# Altium project radxa_cm3i_io_board_v1.4.PrjPcb (part 4 of 4)

## Sheet 22.SchDoc
size 297 x 209 mm
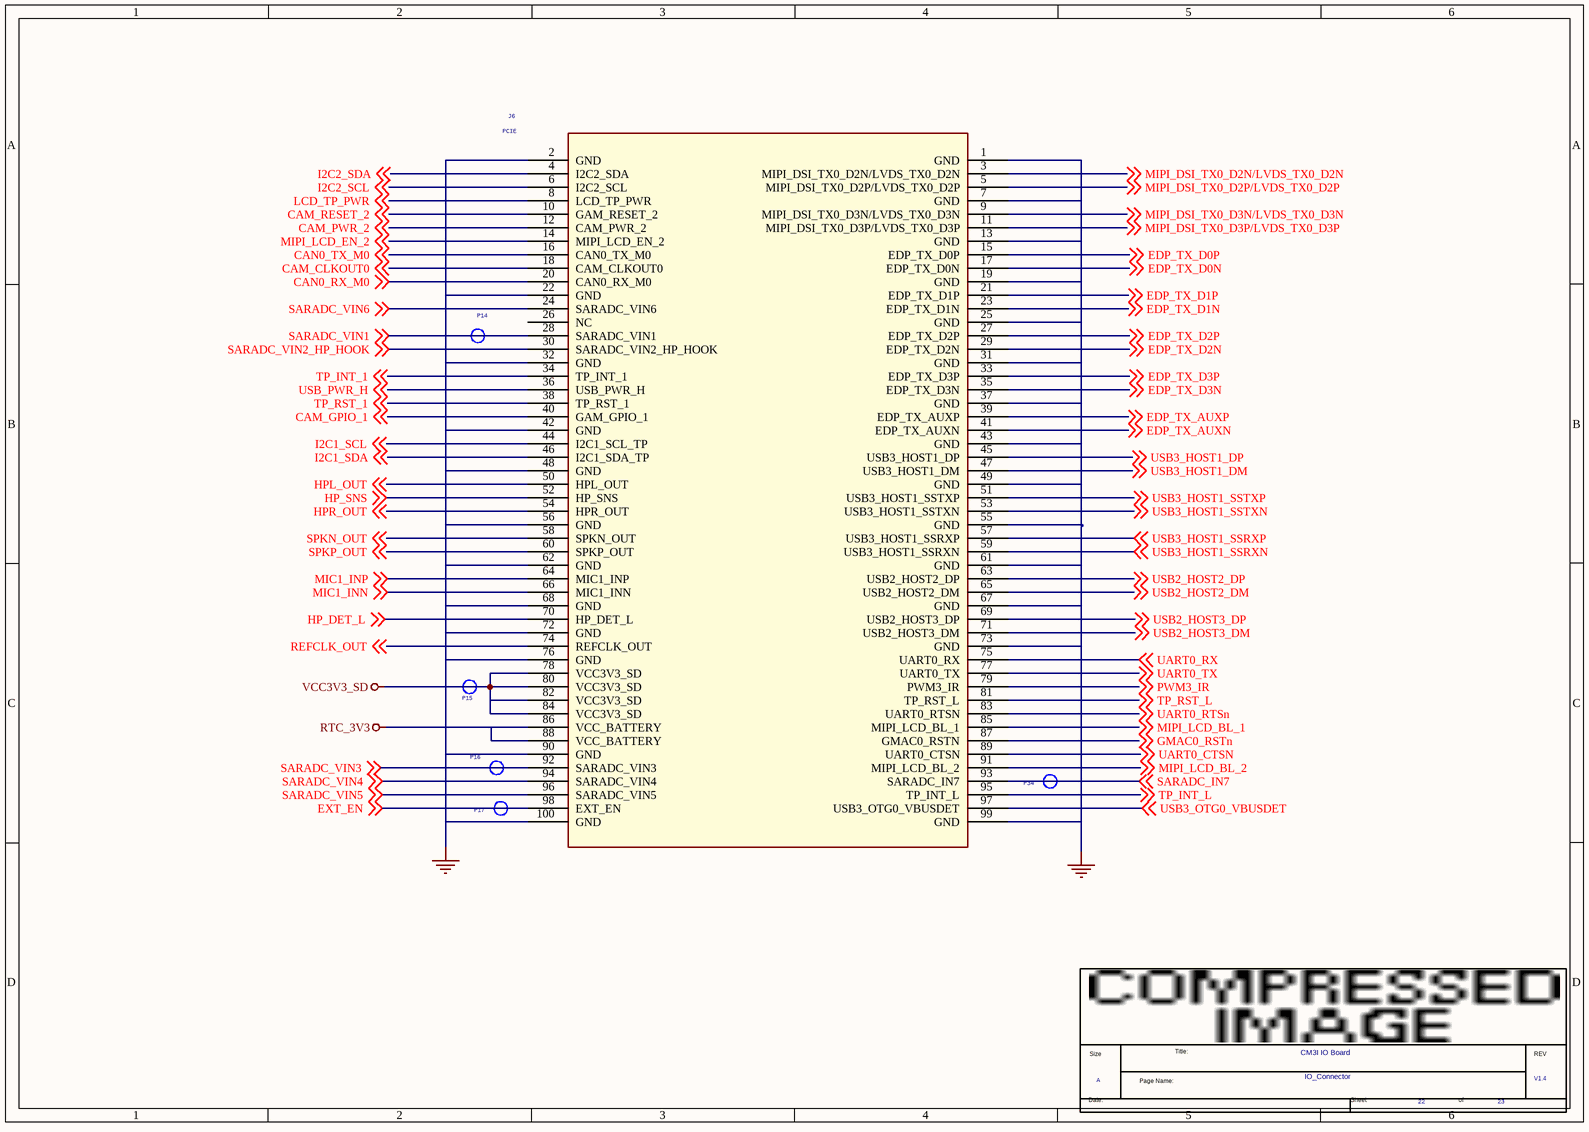
[diagram p20: 22.SchDoc]

### Parts
(Parts that share a designator on the sheet are numbered #1, #2 ... from top to bottom, then left to right.)
*#21  Page Count: 23  Page Number: 22  Page Size: A  Title: CM3I IO Board  RevCode: V1.4  Doc: IO_Connector  (hidden comment: radxa_1010)  (graphical)
J6  PCIE  [DF40C_100DS]
P14  TEST  [TEST]  (value not drawn)
P15  TEST  [TEST]  (value not drawn)
P16  TEST  [TEST]  (value not drawn)
P17  TEST  [TEST]  (value not drawn)
P34  TEST  [TEST]  (value not drawn)

### Nets
GND: J6.1(GND) J6.2(GND) J6.7(GND) J6.13(GND) J6.19(GND) J6.22(GND) J6.25(GND) J6.31(GND) J6.32(GND) J6.37(GND) J6.42(GND) J6.43(GND) J6.48(GND) J6.49(GND) J6.55(GND) J6.56(GND) J6.61(GND) J6.62(GND) J6.67(GND) J6.68(GND) J6.72(GND) J6.73(GND) J6.76(GND) J6.90(GND) J6.99(GND) J6.100(GND)
RTC_3V3: J6.86(VCC_BATTERY) J6.88(VCC_BATTERY)
VCC3V3_SD: J6.78(VCC3V3_SD) J6.80(VCC3V3_SD) J6.82(VCC3V3_SD) J6.84(VCC3V3_SD) P15.1
CAM_CLKOUT0: J6.18(CAM_CLKOUT0) ; off-sheet CAM_CLKOUT0
CAM_GPIO_1: J6.40(GAM_GPIO_1) ; off-sheet CAM_GPIO_1
CAM_PWR_2: J6.12(CAM_PWR_2) ; off-sheet CAM_PWR_2
CAM_RESET_2: J6.10(GAM_RESET_2) ; off-sheet CAM_RESET_2
CAN0_RX_M0: J6.20(CAN0_RX_M0) ; off-sheet CAN0_RX_M0
CAN0_TX_M0: J6.16(CAN0_TX_M0) ; off-sheet CAN0_TX_M0
EDP_TX_AUXN: J6.41(EDP_TX_AUXN) ; off-sheet EDP_TX_AUXN
EDP_TX_AUXP: J6.39(EDP_TX_AUXP) ; off-sheet EDP_TX_AUXP
EDP_TX_D0N: J6.17(EDP_TX_D0N) ; off-sheet EDP_TX_D0N
EDP_TX_D0P: J6.15(EDP_TX_D0P) ; off-sheet EDP_TX_D0P
EDP_TX_D1N: J6.23(EDP_TX_D1N) ; off-sheet EDP_TX_D1N
EDP_TX_D1P: J6.21(EDP_TX_D1P) ; off-sheet EDP_TX_D1P
EDP_TX_D2N: J6.29(EDP_TX_D2N) ; off-sheet EDP_TX_D2N
EDP_TX_D2P: J6.27(EDP_TX_D2P) ; off-sheet EDP_TX_D2P
EDP_TX_D3N: J6.35(EDP_TX_D3N) ; off-sheet EDP_TX_D3N
EDP_TX_D3P: J6.33(EDP_TX_D3P) ; off-sheet EDP_TX_D3P
EXT_EN: J6.98(EXT_EN) P17.1 ; off-sheet EXT_EN
GMAC0_RSTn: J6.87(GMAC0_RSTN) ; off-sheet GMAC0_RSTn
HP_DET_L: J6.70(HP_DET_L) ; off-sheet HP_DET_L
HP_SNS: J6.52(HP_SNS) ; off-sheet HP_SNS
HPL_OUT: J6.50(HPL_OUT) ; off-sheet HPL_OUT
HPR_OUT: J6.54(HPR_OUT) ; off-sheet HPR_OUT
I2C1_SCL: J6.44(I2C1_SCL_TP) ; off-sheet I2C1_SCL
I2C1_SDA: J6.46(I2C1_SDA_TP) ; off-sheet I2C1_SDA
I2C2_SCL: J6.6(I2C2_SCL) ; off-sheet I2C2_SCL
I2C2_SDA: J6.4(I2C2_SDA) ; off-sheet I2C2_SDA
LCD_TP_PWR: J6.8(LCD_TP_PWR) ; off-sheet LCD_TP_PWR
MIC1_INN: J6.66(MIC1_INN) ; off-sheet MIC1_INN
MIC1_INP: J6.64(MIC1_INP) ; off-sheet MIC1_INP
MIPI_DSI_TX0_D2N/LVDS_TX0_D2N: J6.3(MIPI_DSI_TX0_D2N/LVDS_TX0_D2N) ; off-sheet MIPI_DSI_TX0_D2N/LVDS_TX0_D2N
MIPI_DSI_TX0_D2P/LVDS_TX0_D2P: J6.5(MIPI_DSI_TX0_D2P/LVDS_TX0_D2P) ; off-sheet MIPI_DSI_TX0_D2P/LVDS_TX0_D2P
MIPI_DSI_TX0_D3N/LVDS_TX0_D3N: J6.9(MIPI_DSI_TX0_D3N/LVDS_TX0_D3N) ; off-sheet MIPI_DSI_TX0_D3N/LVDS_TX0_D3N
MIPI_DSI_TX0_D3P/LVDS_TX0_D3P: J6.11(MIPI_DSI_TX0_D3P/LVDS_TX0_D3P) ; off-sheet MIPI_DSI_TX0_D3P/LVDS_TX0_D3P
MIPI_LCD_BL_1: J6.85(MIPI_LCD_BL_1) ; off-sheet MIPI_LCD_BL_1
MIPI_LCD_BL_2: J6.91(MIPI_LCD_BL_2) ; off-sheet MIPI_LCD_BL_2
MIPI_LCD_EN_2: J6.14(MIPI_LCD_EN_2) ; off-sheet MIPI_LCD_EN_2
PWM3_IR: J6.79(PWM3_IR) ; off-sheet PWM3_IR
REFCLK_OUT: J6.74(REFCLK_OUT) ; off-sheet REFCLK_OUT
SARADC_IN7: J6.93(SARADC_IN7) P34.1 ; off-sheet SARADC_IN7
SARADC_VIN1: J6.28(SARADC_VIN1) P14.1 ; off-sheet SARADC_VIN1
SARADC_VIN2_HP_HOOK: J6.30(SARADC_VIN2_HP_HOOK) ; off-sheet SARADC_VIN2_HP_HOOK
SARADC_VIN3: J6.92(SARADC_VIN3) P16.1 ; off-sheet SARADC_VIN3
SARADC_VIN4: J6.94(SARADC_VIN4) ; off-sheet SARADC_VIN4
SARADC_VIN5: J6.96(SARADC_VIN5) ; off-sheet SARADC_VIN5
SARADC_VIN6: J6.24(SARADC_VIN6) ; off-sheet SARADC_VIN6
SPKN_OUT: J6.58(SPKN_OUT) ; off-sheet SPKN_OUT
SPKP_OUT: J6.60(SPKP_OUT) ; off-sheet SPKP_OUT
TP_INT_1: J6.34(TP_INT_1) ; off-sheet TP_INT_1
TP_INT_L: J6.95(TP_INT_L) ; off-sheet TP_INT_L
TP_RST_1: J6.38(TP_RST_1) ; off-sheet TP_RST_1
TP_RST_L: J6.81(TP_RST_L) ; off-sheet TP_RST_L
UART0_CTSN: J6.89(UART0_CTSN) ; off-sheet UART0_CTSN
UART0_RTSn: J6.83(UART0_RTSN) ; off-sheet UART0_RTSn
UART0_RX: J6.75(UART0_RX) ; off-sheet UART0_RX
UART0_TX: J6.77(UART0_TX) ; off-sheet UART0_TX
USB2_HOST2_DM: J6.65(USB2_HOST2_DM) ; off-sheet USB2_HOST2_DM
USB2_HOST2_DP: J6.63(USB2_HOST2_DP) ; off-sheet USB2_HOST2_DP
USB2_HOST3_DM: J6.71(USB2_HOST3_DM) ; off-sheet USB2_HOST3_DM
USB2_HOST3_DP: J6.69(USB2_HOST3_DP) ; off-sheet USB2_HOST3_DP
USB3_HOST1_DM: J6.47(USB3_HOST1_DM) ; off-sheet USB3_HOST1_DM
USB3_HOST1_DP: J6.45(USB3_HOST1_DP) ; off-sheet USB3_HOST1_DP
USB3_HOST1_SSRXN: J6.59(USB3_HOST1_SSRXN) ; off-sheet USB3_HOST1_SSRXN
USB3_HOST1_SSRXP: J6.57(USB3_HOST1_SSRXP) ; off-sheet USB3_HOST1_SSRXP
USB3_HOST1_SSTXN: J6.53(USB3_HOST1_SSTXN) ; off-sheet USB3_HOST1_SSTXN
USB3_HOST1_SSTXP: J6.51(USB3_HOST1_SSTXP) ; off-sheet USB3_HOST1_SSTXP
USB3_OTG0_VBUSDET: J6.97(USB3_OTG0_VBUSDET) ; off-sheet USB3_OTG0_VBUSDET
USB_PWR_H: J6.36(USB_PWR_H) ; off-sheet USB_PWR_H

Not connected (* = marked no-connect by the designer): J6 26(NC)

### Notes on the sheet
- (in symbol radxa_1010) Title:; Size; REV; Page Name:; Date:; Sheet; of

### Library data of the parts
J6 = CN_9
P14-P17 P34 = TESTPOINT1
*#21 = radxa_1010: Page Create Date: March  8, 1995

## Sheet 23.SchDoc
size 297 x 209 mm
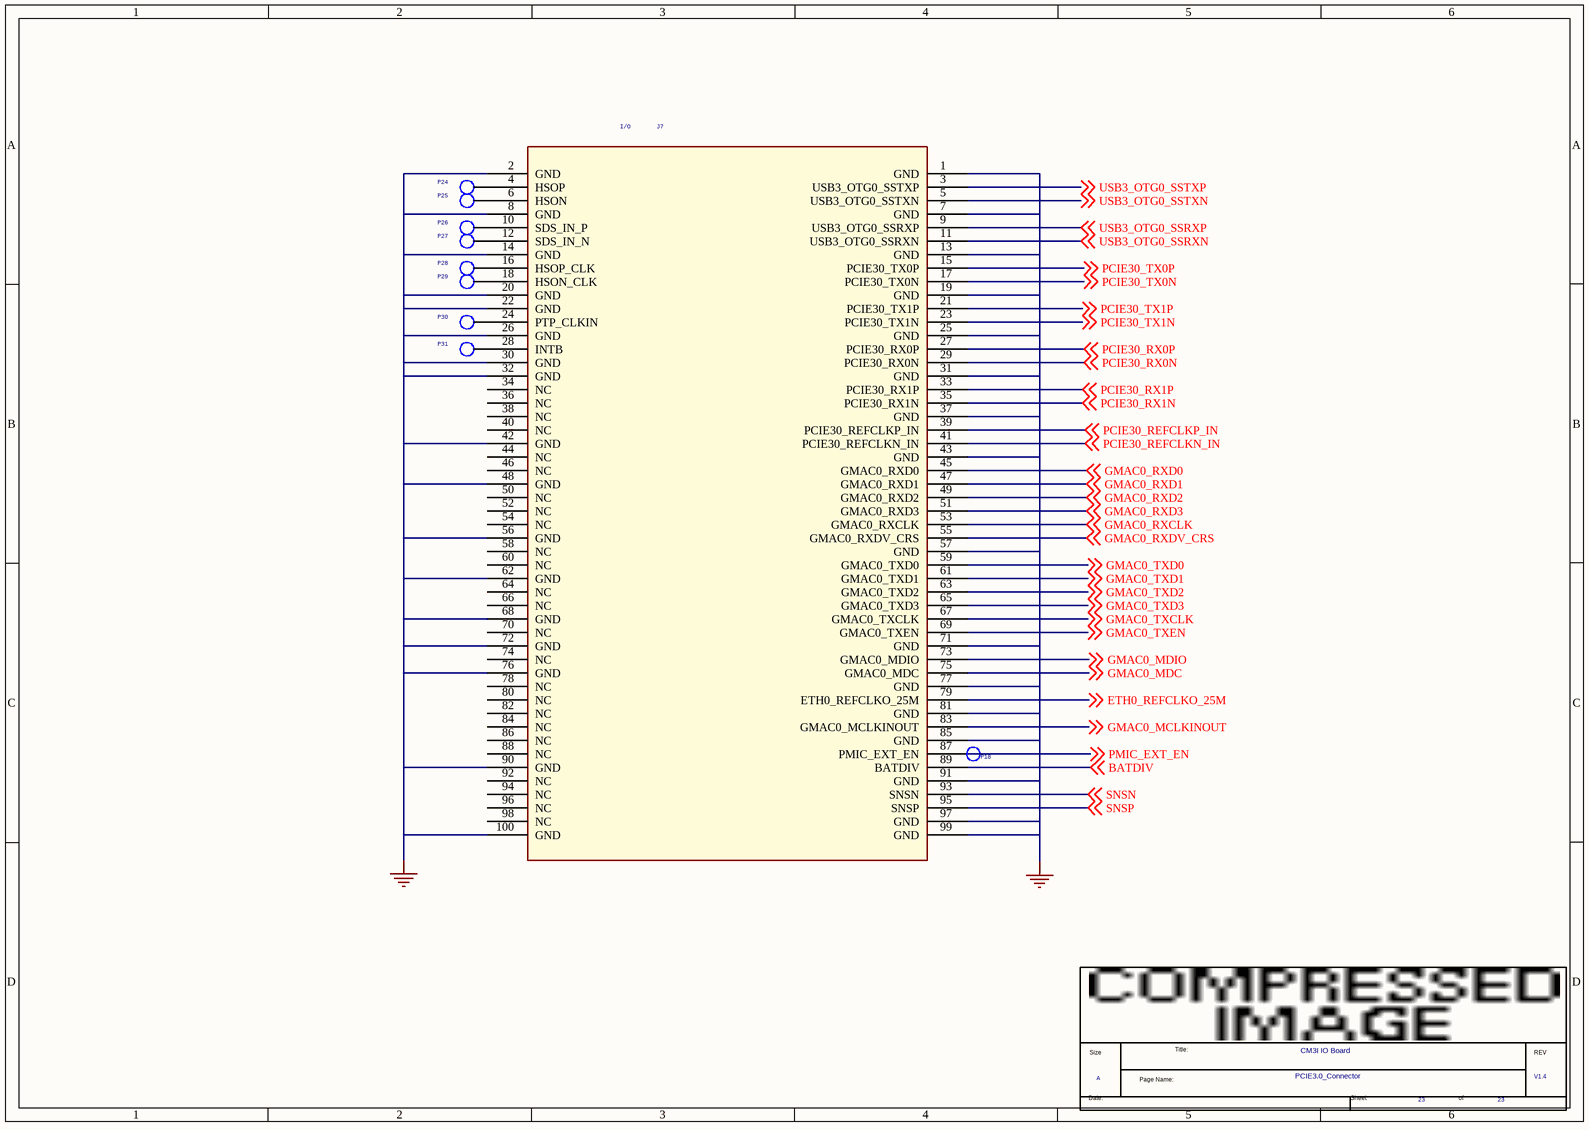
[diagram p21: 23.SchDoc]

### Parts
(Parts that share a designator on the sheet are numbered #1, #2 ... from top to bottom, then left to right.)
*#22  Page Count: 23  Page Size: A  Title: CM3I IO Board  RevCode: V1.4  Doc: PCIE3.0_Connector  (hidden comment: radxa_1010)  (graphical)
J7  I/O  [DF40C_100DS]
P18  TEST  [TEST]  (value not drawn)
P24  TEST  [TEST]  (value not drawn)
P25  TEST  [TEST]  (value not drawn)
P26  TEST  [TEST]  (value not drawn)
P27  TEST  [TEST]  (value not drawn)
P28  TEST  [TEST]  (value not drawn)
P29  TEST  [TEST]  (value not drawn)
P30  TEST  [TEST]  (value not drawn)
P31  TEST  [TEST]  (value not drawn)

### Nets
GND: J7.1(GND) J7.2(GND) J7.7(GND) J7.8(GND) J7.13(GND) J7.14(GND) J7.19(GND) J7.20(GND) J7.22(GND) J7.25(GND) J7.26(GND) J7.30(GND) J7.31(GND) J7.32(GND) J7.37(GND) J7.42(GND) J7.43(GND) J7.48(GND) J7.56(GND) J7.57(GND) J7.62(GND) J7.68(GND) J7.71(GND) J7.72(GND) J7.76(GND) J7.77(GND) J7.81(GND) J7.85(GND) J7.90(GND) J7.91(GND) J7.97(GND) J7.99(GND) J7.100(GND)
BATDIV: J7.89(BATDIV) ; off-sheet BATDIV
ETH0_REFCLKO_25M: J7.79(ETH0_REFCLKO_25M) ; off-sheet ETH0_REFCLKO_25M
GMAC0_MCLKINOUT: J7.83(GMAC0_MCLKINOUT) ; off-sheet GMAC0_MCLKINOUT
GMAC0_MDC: J7.75(GMAC0_MDC) ; off-sheet GMAC0_MDC
GMAC0_MDIO: J7.73(GMAC0_MDIO) ; off-sheet GMAC0_MDIO
GMAC0_RXCLK: J7.53(GMAC0_RXCLK) ; off-sheet GMAC0_RXCLK
GMAC0_RXD0: J7.45(GMAC0_RXD0) ; off-sheet GMAC0_RXD0
GMAC0_RXD1: J7.47(GMAC0_RXD1) ; off-sheet GMAC0_RXD1
GMAC0_RXD2: J7.49(GMAC0_RXD2) ; off-sheet GMAC0_RXD2
GMAC0_RXD3: J7.51(GMAC0_RXD3) ; off-sheet GMAC0_RXD3
GMAC0_RXDV_CRS: J7.55(GMAC0_RXDV_CRS) ; off-sheet GMAC0_RXDV_CRS
GMAC0_TXCLK: J7.67(GMAC0_TXCLK) ; off-sheet GMAC0_TXCLK
GMAC0_TXD0: J7.59(GMAC0_TXD0) ; off-sheet GMAC0_TXD0
GMAC0_TXD1: J7.61(GMAC0_TXD1) ; off-sheet GMAC0_TXD1
GMAC0_TXD2: J7.63(GMAC0_TXD2) ; off-sheet GMAC0_TXD2
GMAC0_TXD3: J7.65(GMAC0_TXD3) ; off-sheet GMAC0_TXD3
GMAC0_TXEN: J7.69(GMAC0_TXEN) ; off-sheet GMAC0_TXEN
PCIE30_REFCLKN_IN: J7.41(PCIE30_REFCLKN_IN) ; off-sheet PCIE30_REFCLKN_IN
PCIE30_REFCLKP_IN: J7.39(PCIE30_REFCLKP_IN) ; off-sheet PCIE30_REFCLKP_IN
PCIE30_RX0N: J7.29(PCIE30_RX0N) ; off-sheet PCIE30_RX0N
PCIE30_RX0P: J7.27(PCIE30_RX0P) ; off-sheet PCIE30_RX0P
PCIE30_RX1N: J7.35(PCIE30_RX1N) ; off-sheet PCIE30_RX1N
PCIE30_RX1P: J7.33(PCIE30_RX1P) ; off-sheet PCIE30_RX1P
PCIE30_TX0N: J7.17(PCIE30_TX0N) ; off-sheet PCIE30_TX0N
PCIE30_TX0P: J7.15(PCIE30_TX0P) ; off-sheet PCIE30_TX0P
PCIE30_TX1N: J7.23(PCIE30_TX1N) ; off-sheet PCIE30_TX1N
PCIE30_TX1P: J7.21(PCIE30_TX1P) ; off-sheet PCIE30_TX1P
PMIC_EXT_EN: J7.87(PMIC_EXT_EN) P18.1 ; off-sheet PMIC_EXT_EN
SNSN: J7.93(SNSN) ; off-sheet SNSN
SNSP: J7.95(SNSP) ; off-sheet SNSP
USB3_OTG0_SSRXN: J7.11(USB3_OTG0_SSRXN) ; off-sheet USB3_OTG0_SSRXN
USB3_OTG0_SSRXP: J7.9(USB3_OTG0_SSRXP) ; off-sheet USB3_OTG0_SSRXP
USB3_OTG0_SSTXN: J7.5(USB3_OTG0_SSTXN) ; off-sheet USB3_OTG0_SSTXN
USB3_OTG0_SSTXP: J7.3(USB3_OTG0_SSTXP) ; off-sheet USB3_OTG0_SSTXP
NetJ7_4: J7.4(HSOP) P24.1
NetJ7_6: J7.6(HSON) P25.1
NetJ7_10: J7.10(SDS_IN_P) P26.1
NetJ7_12: J7.12(SDS_IN_N) P27.1
NetJ7_16: J7.16(HSOP_CLK) P28.1
NetJ7_18: J7.18(HSON_CLK) P29.1
NetJ7_24: J7.24(PTP_CLKIN) P30.1
NetJ7_28: J7.28(INTB) P31.1

Not connected (* = marked no-connect by the designer): J7 34(NC) 36(NC) 38(NC) 40(NC) 44(NC) 46(NC) 50(NC) 52(NC) 54(NC) 58(NC) 60(NC) 64(NC) 66(NC) 70(NC) 74(NC) 78(NC) 80(NC) 82(NC) 84(NC) 86(NC) 88(NC) 92(NC) 94(NC) 96(NC) 98(NC)

### Notes on the sheet
- (in symbol radxa_1010) Title:; Size; REV; Page Name:; Date:; Sheet; of

### Library data of the parts
J7 = CN_10
P18 P24-P31 = TESTPOINT1
*#22 = radxa_1010: Page Number: 23; Page Create Date: March  8, 1995

## Nets that join several sheets
+1V8: 04 (Q16.1 Q18.1 R43.1 R46.1), 10 (Q17.1 R38.1), 12 (C264.1 C267.1 R416.1), 14 (C221.1 R322.2), 16 (R395.1), 20 (R36.2 U38.88 U38.90)
+3V3: 08 (R120.1), 18 (R190.1 R197.2 R198.1), 20 (R35.2 U38.84 U38.86)
+5V_INPUT: 13 (D17.1), 18 (10 pins), 20 (6 pins)
GND: 04 (34 pins), 05 (37 pins), 06 (32 pins), 07 (25 pins), 08 (48 pins), 09 (19 pins), 10 (16 pins), 11 (52 pins), 12 (36 pins), 13 (34 pins), 14 (39 pins), 15 (19 pins), 16 (52 pins), 17 (9 pins), 18 (49 pins), 19 (12 pins), 20 (21 pins), 21 (34 pins), 22 (26 pins), 23 (33 pins)
RTC_3V3: 17 (C233.1 D36.3 U36.8), 22 (J6.86 J6.88)
VCC3V3_SYS: 04 (13 pins), 09 (5 pins), 10 (6 pins), 11 (5 pins), 12 (Q19.2 R333.1 R417.2 R419.1), 13 (C107.1 Q2.2 R176.1 R177.1), 14 (R16.1), 15 (R232.2 R238.2), 16 (R396.1 R399.1), 17 (D36.2 R346.2 R347.1), 18 (8 pins), 20 (R34.2)
VCC5V0_USB: 12 (FB10.1 R334.1), 14 (5 pins), 17 (D37.2 U37.2), 18 (7 pins)
VCC5V_P: 04 (R26.2), 07 (5 pins), 08 (C52.1 U10.1), 11 (R297.1 R302.1), 18 (C138.1 C139.1 Q3.3 R194.1)
VCC12V: 05 (C45.1 C46.1 R111.1 U9.5), 06 (C36.1 C37.1 R106.1 U8.5), 07 (C149.1 C150.1 R224.1 U25.5), 11 (C203.1 Q6.2 R296.1 R301.1), 18 (11 pins)
VCC12V_DCIN: 18 (10 pins), 19 (6 pins)
4G_DISABLE: 05 (U7.8), 20 (U38.29)
4G_PWREN_H: 05 (U7.6), 20 (U38.25)
4G_RESET: 05 (U7.67), 20 (U38.31)
4G_WAKE_ON_HOST: 05 (U7.23), 20 (U38.91)
CAM_CLKOUT0: 10 (Q17.2 R38.2 R165.2), 22 (J6.18)
CAM_GPIO: 10 (J8.5), 20 (U38.97)
CAM_GPIO_1: 10 (J4.5), 22 (J6.40)
CAN0_RX_M0: 04 (R31.1), 22 (J6.20)
CAN0_TX_M0: 04 (R29.1), 22 (J6.16)
EDP_TX_AUXN: 11 (R284.1 R287.2 R289.2), 22 (J6.41)
EDP_TX_AUXP: 11 (R276.1 R285.2 R288.2), 22 (J6.39)
EDP_TX_D0N: 11 (R278.2 R281.2), 22 (J6.17)
EDP_TX_D0P: 11 (R279.2 R282.2), 22 (J6.15)
EDP_TX_D1N: 11 (R280.2 R283.2), 22 (J6.23)
EDP_TX_D1P: 11 (R277.2 R286.2), 22 (J6.21)
EDP_TX_D2N: 11 (LCD1.6), 22 (J6.29)
EDP_TX_D2P: 11 (LCD1.7), 22 (J6.27)
EDP_TX_D3N: 11 (LCD1.3), 22 (J6.35)
EDP_TX_D3P: 11 (LCD1.4), 22 (J6.33)
ETH0_REFCLKO_25M: 16 (R362.1), 23 (J7.79)
GMAC0_MCLKINOUT: 16 (R363.1 R364.1), 23 (J7.83)
GMAC0_MDC: 16 (U41.13), 23 (J7.75)
GMAC0_MDIO: 16 (R397.2 U41.14), 23 (J7.73)
GMAC0_RSTn: 16 (R393.1), 22 (J6.87)
GMAC0_RXCLK: 16 (R400.2), 23 (J7.53)
GMAC0_RXD0: 16 (R382.1 R383.2 U41.25), 23 (J7.45)
GMAC0_RXD1: 16 (R386.1 R387.2 U41.24), 23 (J7.47)
GMAC0_RXD2: 16 (R388.1 R389.2 U41.23), 23 (J7.49)
GMAC0_RXD3: 16 (R372.2 U41.22), 23 (J7.51)
GMAC0_RXDV_CRS: 16 (R379.1 U41.26), 23 (J7.55)
GMAC0_TXCLK: 16 (R398.2), 23 (J7.67)
GMAC0_TXD0: 16 (U41.18), 23 (J7.59)
GMAC0_TXD1: 16 (U41.17), 23 (J7.61)
GMAC0_TXD2: 16 (U41.16), 23 (J7.63)
GMAC0_TXD3: 16 (U41.15), 23 (J7.65)
GMAC0_TXEN: 16 (U41.19), 23 (J7.69)
HDMI_TX0N_PORT: 13 (J19.9 U22.2 U22.9), 21 (U38.184)
HDMI_TX0P_PORT: 13 (J19.7 U22.1 U22.10), 21 (U38.182)
HDMI_TX1N_PORT: 13 (J19.6 U21.5 U21.6), 21 (U38.178)
HDMI_TX1P_PORT: 13 (J19.4 U21.4 U21.7), 21 (U38.176)
HDMI_TX2N_PORT: 13 (J19.3 U21.2 U21.9), 21 (U38.172)
HDMI_TX2P_PORT: 13 (J19.1 U21.1 U21.10), 21 (U38.170)
HDMI_TX_CEC_PORT: 13 (ED16.1 J19.13), 21 (U38.151)
HDMI_TX_HPD_PORT: 13 (ED13.1 J19.19), 21 (U38.153)
HDMI_TXCLKN_PORT: 13 (J19.12 U22.5 U22.6), 21 (U38.190)
HDMI_TXCLKP_PORT: 13 (J19.10 U22.4 U22.7), 21 (U38.188)
HDMI_TXDDC_SCL_PORT: 13 (ED15.1 J19.15), 21 (U38.200)
HDMI_TXDDC_SDA_PORT: 13 (ED14.1 J19.16), 21 (U38.199)
HP_DET_L: 14 (U39.10), 22 (J6.70)
HP_SNS: 14 (U39.6), 22 (J6.52)
HPL_OUT: 14 (U39.4), 22 (J6.50)
HPR_OUT: 14 (U39.8), 22 (J6.54)
I2C0_SCL_PMIC: 10 (J8.3), 20 (U38.80)
I2C0_SDA_PMIC: 10 (J8.2), 20 (U38.82)
I2C1_SCL: 17 (R348.1), 22 (J6.44)
I2C1_SDA: 17 (R349.1), 22 (J6.46)
I2C2_SCL: 12 (RP1.5), 22 (J6.6)
I2C2_SDA: 12 (RP1.6), 22 (J6.4)
I2C5_SCL_M0: 10 (J4.3), 11 (RP2.8), 20 (U38.35)
I2C5_SDA_M0: 10 (J4.2), 11 (RP2.7), 20 (U38.36)
I2S3_MCLK_M0: 09 (R155.2), 20 (U38.41)
LCD_RESET: 12 (R411.1), 20 (U38.46)
LCD_TP_PWR: 11 (R345.2), 22 (J6.8)
MIC1_INN: 14 (C86.2 R40.2 U39.13), 22 (J6.66)
MIC1_INP: 14 (C86.1 R320.2 R322.1 U39.14), 22 (J6.64)
MIPI_BL_EN_1: 12 (R328.1 R337.1), 20 (U38.37)
MIPI_BL_EN_2: 11 (R307.1), 20 (U38.20)
MIPI_CSI_RX_CLK0N: 10 (J8.8), 21 (U38.127)
MIPI_CSI_RX_CLK0P: 10 (J8.7), 21 (U38.129)
MIPI_CSI_RX_CLK1N: 10 (J4.8), 21 (U38.140)
MIPI_CSI_RX_CLK1P: 10 (J4.7), 21 (U38.142)
MIPI_CSI_RX_D0N: 10 (J8.14), 21 (U38.115)
MIPI_CSI_RX_D0P: 10 (J8.13), 21 (U38.117)
MIPI_CSI_RX_D1N: 10 (J8.11), 21 (U38.121)
MIPI_CSI_RX_D1P: 10 (J8.10), 21 (U38.123)
MIPI_CSI_RX_D2N: 10 (J4.14), 21 (U38.128)
MIPI_CSI_RX_D2P: 10 (J4.13), 21 (U38.130)
MIPI_CSI_RX_D3N: 10 (J4.11), 21 (U38.134)
MIPI_CSI_RX_D3P: 10 (J4.10), 21 (U38.136)
MIPI_DSI_TX0_CLKN/LVDS_TX0_CLKN: 12 (U42.13), 21 (U38.169)
MIPI_DSI_TX0_CLKP/LVDS_TX0_CLKP: 12 (U42.14), 21 (U38.171)
MIPI_DSI_TX0_D0N/LVDS_TX0_D0N: 12 (U42.7), 21 (U38.157)
MIPI_DSI_TX0_D0P/LVDS_TX0_D0P: 12 (U42.8), 21 (U38.159)
MIPI_DSI_TX0_D1N/LVDS_TX0_D1N: 12 (U42.10), 21 (U38.163)
MIPI_DSI_TX0_D1P/LVDS_TX0_D1P: 12 (U42.11), 21 (U38.165)
MIPI_DSI_TX0_D2N/LVDS_TX0_D2N: 12 (U42.16), 22 (J6.3)
MIPI_DSI_TX0_D2P/LVDS_TX0_D2P: 12 (U42.17), 22 (J6.5)
MIPI_DSI_TX0_D3N/LVDS_TX0_D3N: 12 (U42.19), 22 (J6.9)
MIPI_DSI_TX0_D3P/LVDS_TX0_D3P: 12 (U42.20), 22 (J6.11)
MIPI_LCD_BL_1: 12 (R331.1), 22 (J6.85)
MIPI_LCD_BL_2: 11 (R290.1 R294.1), 22 (J6.91)
MIPI_LCD_EN_2: 11 (R308.1 R310.1), 22 (J6.14)
MIPI_TP_PWR: 12 (R418.2), 21 (U38.109)
PCIE20-CLKREQN: 05 (R99.1), 20 (U38.40)
PCIE20-PERSTN: 05 (R103.1), 20 (U38.47)
PCIE20-WAKEN: 05 (R101.1), 20 (U38.44)
PCIE20_CLKREQn_M2: 07 (R55.1 R219.1), 21 (U38.102)
PCIE20_REFCLKN: 05 (U7.53), 21 (U38.112)
PCIE20_REFCLKP: 05 (U7.55), 21 (U38.110)
PCIE20_RXN: 09 (U12.7), 21 (U38.118)
PCIE20_RXN_1: 05 (U7.41), 09 (U12.15)
PCIE20_RXP: 09 (U12.6), 21 (U38.116)
PCIE20_RXP_1: 05 (U7.43), 09 (U12.16)
PCIE20_TXN: 09 (U12.3), 21 (U38.124)
PCIE20_TXN_1: 05 (C27.1), 09 (U12.17)
PCIE20_TXP: 09 (U12.2), 21 (U38.122)
PCIE20_TXP_1: 05 (C29.1), 09 (U12.18)
PCIE30_CLKN_EKEY: 07 (U24.49), 08 (R137.2 R143.1)
PCIE30_CLKP_EKEY: 07 (U24.47), 08 (R136.2 R141.1)
PCIE30_CLKREQn_M1: 07 (R220.1 R223.1), 20 (U38.39)
PCIE30_PERSTn_M1: 07 (R221.1), 20 (U38.45)
PCIE30_REFCLKN_IN: 08 (R128.2 R129.1), 23 (J7.41)
PCIE30_REFCLKN_MKEY: 06 (U6.53), 08 (R132.2 R133.1)
PCIE30_REFCLKP_IN: 08 (R127.2 R130.1), 23 (J7.39)
PCIE30_REFCLKP_MKEY: 06 (U6.55), 08 (R131.2 R134.1)
PCIE30_RX0N: 06 (U6.41), 23 (J7.29)
PCIE30_RX0P: 06 (U6.43), 23 (J7.27)
PCIE30_RX1N: 07 (U24.43), 23 (J7.35)
PCIE30_RX1P: 07 (U24.41), 23 (J7.33)
PCIE30_TX0N: 06 (C28.1), 23 (J7.17)
PCIE30_TX0P: 06 (C30.1), 23 (J7.15)
PCIE30_TX1N: 07 (C147.1), 23 (J7.23)
PCIE30_TX1P: 07 (C146.1), 23 (J7.21)
PCIE30_WAKEn_M1: 07 (R222.1), 20 (U38.38)
PCIE30X2_CLKREQn_M1: 06 (R98.1), 20 (U38.89)
PCIE30X2_PERSTn_M1: 06 (R102.1), 20 (U38.54)
PCIE30X2_WAKEn_M1: 06 (R100.1), 20 (U38.28)
PCIE_PWREN_H: 05 (R113.1), 06 (R108.1), 07 (R226.1), 20 (U38.95)
PHY1_1MDI0+: 15 (FB5.1), 20 (U38.12)
PHY1_1MDI0-: 15 (FB5.4), 20 (U38.10)
PHY1_1MDI1+: 15 (FB6.1), 20 (U38.4)
PHY1_1MDI1-: 15 (FB6.4), 20 (U38.6)
PHY1_1MDI2+: 15 (FB9.1), 20 (U38.11)
PHY1_1MDI2-: 15 (FB9.4), 20 (U38.9)
PHY1_1MDI3+: 15 (FB16.1), 20 (U38.3)
PHY1_1MDI3-: 15 (FB16.4), 20 (U38.5)
PHY1_LED0_Y1: 15 (R234.1), 20 (U38.19)
PHY1_LED1_G: 15 (R230.2 R231.1), 20 (U38.17)
PHY1_LED2_Y: 15 (R233.1), 20 (U38.15)
PI_nLED_Activity: 14 (R19.2), 20 (U38.21)
PMIC_RESET_KEY: 17 (R350.1), 20 (U38.100)
PWM3_IR: 09 (R156.1), 22 (J6.79)
PWM8_M0: 17 (R352.1), 20 (U38.48)
PWM9_M0: 07 (R52.1 R218.1), 20 (U38.50)
PWRON_KEY: 14 (D14.2 SW3.1), 17 (R351.1), 20 (U38.99)
REFCLK_OUT: 10 (R166.1), 22 (J6.74)
RN1_V+: 15 (J21.13), 19 (U33.1)
RN2_V+: 15 (J21.14), 19 (U33.2)
RS485_RE: 04 (R17.1), 20 (U38.24)
SARADC_VIN0_KEY/RECOVERY: 14 (R37.1 U39.7), 20 (U38.93)
SARADC_VIN2_HP_HOOK: 14 (C220.1 R320.1 R321.2 U39.12), 22 (J6.30)
SARADC_VIN4: 17 (Q15.2 R353.1), 22 (J6.94)
SARADC_VIN5: 19 (R316.1), 22 (J6.96)
SARADC_VIN6: 18 (R189.1), 22 (J6.24)
SDMMC0_CLK: 13 (R175.1), 20 (U38.57)
SDMMC0_CMD: 13 (CN14A1.3 ED10.1), 20 (U38.62)
SDMMC0_D0: 13 (CN14A1.7 ED8.1), 20 (U38.63)
SDMMC0_D1: 13 (CN14A1.8 ED7.1), 20 (U38.67)
SDMMC0_D2/ARMJTAG_TCK: 13 (CN14A1.1 ED12.1), 20 (U38.69)
SDMMC0_D3/ARMJTAG_TMS: 13 (CN14A1.2 ED11.1), 20 (U38.61)
SDMMC0_DET_L: 13 (CN14A1.9 ED6.1), 20 (U38.76)
SDMMC_PWREN: 13 (R178.2), 20 (U38.75)
SPKN_OUT: 14 (U39.9), 22 (J6.58)
SPKP_OUT: 14 (U39.11), 22 (J6.60)
TN1_V+: 15 (J21.11), 19 (U32.1)
TN2_V+: 15 (J21.12), 19 (U32.2)
TP_INT_1: 11 (RP2.6), 22 (J6.34)
TP_INT_L: 12 (RP1.7), 22 (J6.95)
TP_RST_1: 11 (RP2.5), 22 (J6.38)
TP_RST_L: 12 (RP1.8), 22 (J6.81)
UART0_CTSN: 07 (R49.1 R50.1 R53.1), 22 (J6.89)
UART0_RTSn: 07 (R51.1 R54.1), 22 (J6.83)
UART0_RX: 04 (R45.2), 22 (J6.75)
UART0_TX: 04 (R48.2), 22 (J6.77)
UART2_RX: 14 (R5.1), 20 (U38.51)
UART2_TX: 14 (R6.1), 20 (U38.55)
UART5_RX_M1: 04 (R14.1), 20 (U38.26)
UART5_TX_M1: 04 (R20.1 R22.1), 20 (U38.49)
USB2_HOST2_DM: 14 (FB15.1 R422.1), 22 (J6.65)
USB2_HOST2_DP: 14 (FB15.4 R423.1), 22 (J6.63)
USB2_HOST3_DM: 07 (FB4.4 R210.1), 22 (J6.71)
USB2_HOST3_DP: 07 (FB4.1 R209.1), 22 (J6.69)
USB3_HOST1_DM: 05 (U7.9), 22 (J6.47)
USB3_HOST1_DP: 05 (U7.7), 22 (J6.45)
USB3_HOST1_SSRXN: 05 (U7.35), 22 (J6.59)
USB3_HOST1_SSRXP: 05 (U7.37), 22 (J6.57)
USB3_HOST1_SSTXN: 05 (U7.29), 22 (J6.53)
USB3_HOST1_SSTXP: 05 (U7.31), 22 (J6.51)
USB3_OTG0_SSRXN: 14 (D41.2 USB6.5), 23 (J7.11)
USB3_OTG0_SSRXP: 14 (D42.2 USB6.6), 23 (J7.9)
USB3_OTG0_SSTXN: 14 (C234.1), 23 (J7.5)
USB3_OTG0_SSTXP: 14 (C235.1), 23 (J7.3)
USB3_OTG0_VBUSDET: 14 (R203.2), 22 (J6.97)
USB_OTG0_DM: 14 (L6801.4 R355.2), 21 (U38.103)
USB_OTG0_DP: 14 (L6801.2 R356.2), 21 (U38.105)
USB_OTG0_ID: 14 (R204.2), 21 (U38.101)
USB_PWR_H: 14 (R200.2), 22 (J6.36)
W_DISABLE: 05 (U7.26), 20 (U38.27)